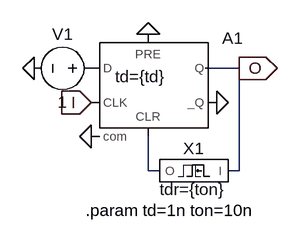
[diagram p0: schematic oneshot.asc]
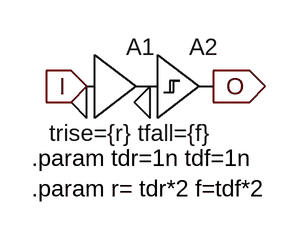
[diagram p1: sub-circuit delay.asc]
oneshot.asc, the LTspice schematic file:
Version 4
SHEET 1 880 680
WIRE 256 48 208 48
WIRE 128 192 128 144
WIRE 144 192 128 192
WIRE 256 192 256 48
WIRE 256 192 240 192
FLAG 256 48 O
IOPIN 256 48 Out
FLAG 48 96 I
IOPIN 48 96 In
FLAG 48 144 0
FLAG 128 0 0
FLAG 224 96 0
FLAG -32 48 0
SYMBOL delay 192 192 M0
WINDOW 39 1 42 Bottom 2
SYMATTR SpiceLine tdr={ton}
SYMATTR InstName X1
SYMBOL Digital\\dflop 128 0 R0
WINDOW 3 -46 60 Left 2
SYMATTR Value td={td}
SYMATTR InstName A1
SYMBOL voltage 64 48 R90
WINDOW 0 -32 56 VBottom 2
WINDOW 3 32 56 VTop 2
SYMATTR InstName V1
SYMATTR Value 1
TEXT 40 248 Left 2 !.param td=1n ton=10n

delay.asc, the sub-circuit schematic file:
Version 4
SHEET 1 880 680
FLAG 144 176 0
FLAG 208 176 0
FLAG 272 160 O
IOPIN 272 160 Out
FLAG 144 160 I
IOPIN 144 160 In
SYMBOL Digital\\buf1 144 96 R0
WINDOW 3 -38 111 Left 2
SYMATTR Value trise={r} tfall={f}
SYMATTR InstName A1
SYMBOL Digital\\schmtbuf 208 96 R0
SYMATTR InstName A2
TEXT 88 232 Left 2 !.param tdr=1n tdf=1n\n.param r= tdr*2 f=tdf*2

The netlist it stands for:
* oneshot.asc
XX1 O N001 delay params: tdr={ton}
A1 P001 0 I 0 N001 0 O 0 DFLOP td={td}
V1 P001 0 1

* block symbol definitions
.subckt delay I O
A1 I 0 0 0 0 0 P001 0 BUF trise={r} tfall={f}
A2 P001 0 0 0 0 0 O 0 SCHMITT
.param tdr=1n tdf=1n
.param r= tdr*2 f=tdf*2
.ends delay

.param td=1n ton=10n
.backanno
.end